# EAGLE design Alignment (EAGLE 6.6.0)
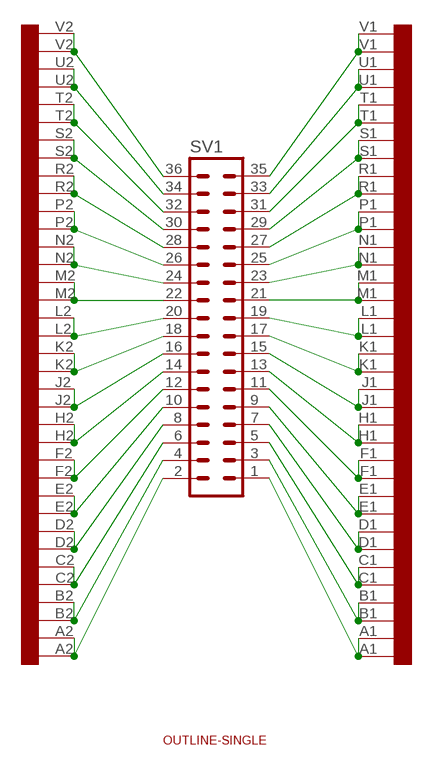
[diagram p0: schematic, sheet 1]

## Parts
EDGE  EDGE-2ECONO  [ECONOSINGLE]
SV1  MA18-2  [MA18-2]
U$1  EDGE-2CONNECTOR  [EDGE-CON2]
U$3  OUTLINE-SINGLE  [SINGLE]

## Nets
N$1: EDGE.V2 SV1.36 U$1.V2
N$2: EDGE.U2 SV1.34 U$1.U2
N$3: EDGE.T2 SV1.32 U$1.T2
N$4: EDGE.S2 SV1.30 U$1.S2
N$5: EDGE.R2 SV1.28 U$1.R2
N$6: EDGE.P2 SV1.26 U$1.P2
N$7: EDGE.N2 SV1.24 U$1.N2
N$8: EDGE.M2 SV1.22 U$1.M2
N$9: EDGE.L2 SV1.20 U$1.L2
N$10: EDGE.K2 SV1.18 U$1.K2
N$11: EDGE.J2 SV1.16 U$1.J2
N$12: EDGE.H2 SV1.14 U$1.H2
N$13: EDGE.F2 SV1.12 U$1.F2
N$14: EDGE.E2 SV1.10 U$1.E2
N$15: EDGE.D2 SV1.8 U$1.D2
N$16: EDGE.C2 SV1.6 U$1.C2
N$17: EDGE.B2 SV1.4 U$1.B2
N$18: EDGE.A2 SV1.2 U$1.A2
N$19: EDGE.V1 SV1.35 U$1.V1
N$20: EDGE.U1 SV1.33 U$1.U1
N$21: EDGE.T1 SV1.31 U$1.T1
N$22: EDGE.S1 SV1.29 U$1.S1
N$23: EDGE.R1 SV1.27 U$1.R1
N$24: EDGE.P1 SV1.25 U$1.P1
N$25: EDGE.N1 SV1.23 U$1.N1
N$26: EDGE.M1 SV1.21 U$1.M1
N$27: EDGE.L1 SV1.19 U$1.L1
N$28: EDGE.K1 SV1.17 U$1.K1
N$29: EDGE.J1 SV1.15 U$1.J1
N$30: EDGE.H1 SV1.13 U$1.H1
N$31: EDGE.F1 SV1.11 U$1.F1
N$32: EDGE.E1 SV1.9 U$1.E1
N$33: EDGE.D1 SV1.7 U$1.D1
N$34: EDGE.C1 SV1.5 U$1.C1
N$35: EDGE.B1 SV1.3 U$1.B1
N$36: EDGE.A1 SV1.1 U$1.A1

## Library data of the parts
EDGE U$1 = dec-con:EDGE-2: Double-Sided DEC edge connector.
SV1 = con-lstb:MA18-2: PIN HEADER; OC_FARNELL: unknown; OC_NEWARK: unknown
U$3 = dec-con:OUTLINE-*: Board outlines for DEC boards.

## Net classes
0 default: width 0.508 mm

## Board
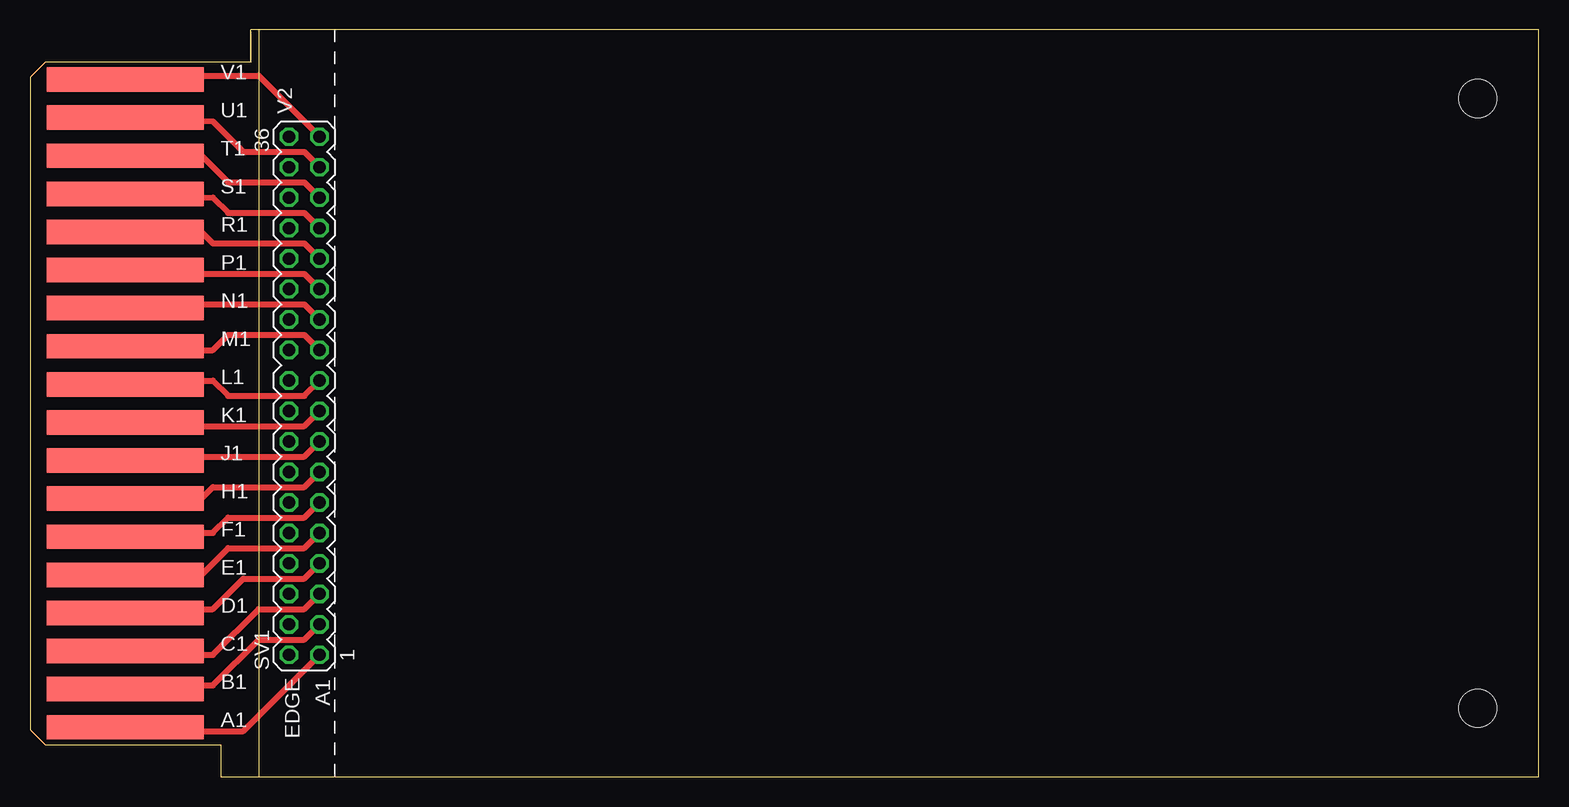
[diagram p1: board, top side]
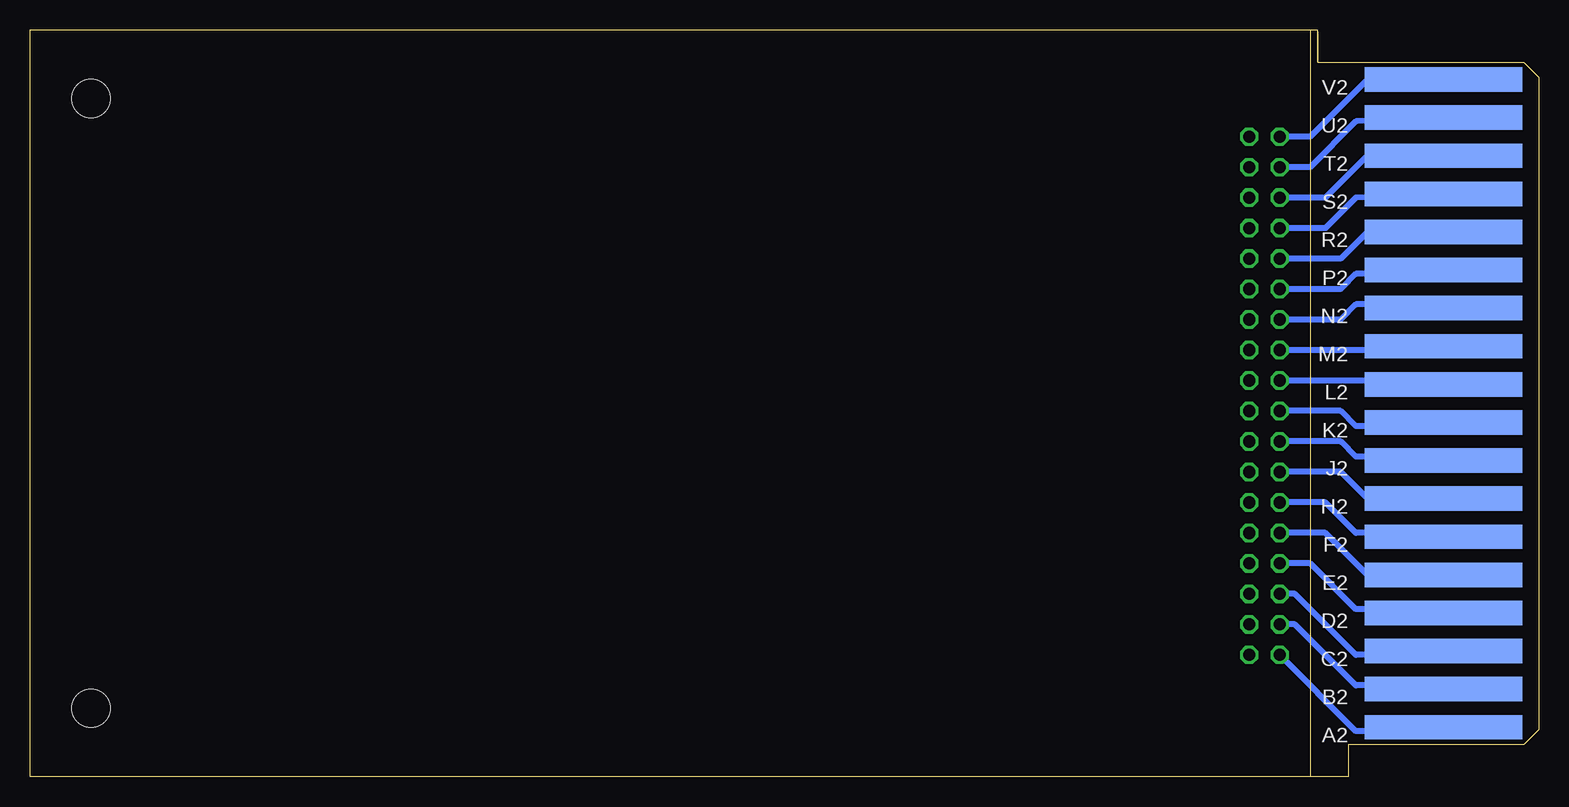
[diagram p2: board, bottom side, seen from below]

Size 125.73 x 62.23 mm. Coordinates in mm from the lower left corner, seen from the top.
Copper layers (1+16): Top 0.035mm / dielectric 1.5mm / Bottom 0.035mm
Design rules "16mils": minimum track width 16mil, minimum drill 32mil, track to track 15mil, track to pad 10mil, pad to pad 10mil, via to via 10mil, smd to smd 10mil, copper to edge 13mil, drill to drill 10mil, minimum pad ring 10mil, minimum via ring 8mil, stop-mask expansion 0mil, vias tented up to drill 0mil, thermal gap 10mil

### Footprints (pad centres in the part's own frame; a part is rotated, then mirrored left to right if it is on the bottom)
ECONOSINGLE = drill 1.016 octagon: A1 5.08,10.16; A2 2.54,10.16; B1 5.08,12.7; B2 2.54,12.7; C1 5.08,15.24; C2 2.54,15.24; D1 5.08,17.78; D2 2.54,17.78; E1 5.08,20.32; E2 2.54,20.32; F1 5.08,22.86; F2 2.54,22.86; H1 5.08,25.4; H2 2.54,25.4; J1 5.08,27.94; J2 2.54,27.94; K1 5.08,30.48; K2 2.54,30.48; L1 5.08,33.02; L2 2.54,33.02; M1 5.08,35.56; M2 2.54,35.56; N1 5.08,38.1; N2 2.54,38.1; P1 5.08,40.64; P2 2.54,40.64; R1 5.08,43.18; R2 2.54,43.18; S1 5.08,45.72; S2 2.54,45.72; T1 5.08,48.26; T2 2.54,48.26; U1 5.08,50.8; U2 2.54,50.8; V1 5.08,53.34; V2 2.54,53.34 | hole 3.175: 101.6,56.515; 101.6,5.715
MA18-2 = drill 1.016 octagon: 1 -21.59,-1.27; 2 -21.59,1.27; 3 -19.05,-1.27; 4 -19.05,1.27; 5 -16.51,-1.27; 6 -16.51,1.27; 7 -13.97,-1.27; 8 -13.97,1.27; 9 -11.43,-1.27; 10 -11.43,1.27; 11 -8.89,-1.27; 12 -8.89,1.27; 13 -6.35,-1.27; 14 -6.35,1.27; 15 -3.81,-1.27; 16 -3.81,1.27; 17 -1.27,-1.27; 18 -1.27,1.27; 19 1.27,-1.27; 20 1.27,1.27; 21 3.81,-1.27; 22 3.81,1.27; 23 6.35,-1.27; 24 6.35,1.27; 25 8.89,-1.27; 26 8.89,1.27; 27 11.43,-1.27; 28 11.43,1.27; 29 13.97,-1.27; 30 13.97,1.27; 31 16.51,-1.27; 32 16.51,1.27; 33 19.05,-1.27; 34 19.05,1.27; 35 21.59,-1.27; 36 21.59,1.27
EDGE-CON2 = smd 13.106 x 2.032: A1 7.938,4.128; B1 7.938,7.303; C1 7.938,10.477; D1 7.938,13.652; E1 7.938,16.828; F1 7.938,20.003; H1 7.938,23.177; J1 7.938,26.352; K1 7.938,29.527; L1 7.938,32.703; M1 7.938,35.877; N1 7.938,39.053; P1 7.938,42.227; R1 7.938,45.403; S1 7.938,48.578; T1 7.938,51.752; U1 7.938,54.928; V1 7.938,58.102 | smd 13.106 x 2.032 bottom: A2 7.938,4.128; B2 7.938,7.303; C2 7.938,10.477; D2 7.938,13.652; E2 7.938,16.828; F2 7.938,20.003; H2 7.938,23.177; J2 7.938,26.352; K2 7.938,29.527; L2 7.938,32.703; M2 7.938,35.877; N2 7.938,39.053; P2 7.938,42.227; R2 7.938,45.403; S2 7.938,48.578; T2 7.938,51.752; U2 7.938,54.928; V2 7.938,58.102
SINGLE = hole 3.175: 120.65,56.515; 120.65,5.715

### Placement (x,y rotation side)
EDGE  19.05,0 0 top
SV1  22.86,31.75 90 top
U$1  0,0 0 top
U$3  0,0 0 top

### Tracks (layer width: path | path; a pad name or v marks a point on that pad's centre or on a via)
N$1
  Bottom 0.508: EDGE.V2 19.05,53.34 13.97,58.42 U$1.V2
N$2
  Bottom 0.508: EDGE.U2 19.05,50.8 15.24,54.61 U$1.U2
N$3
  Bottom 0.508: EDGE.T2 17.78,48.26 13.97,52.07 U$1.T2
N$4
  Bottom 0.508: EDGE.S2 17.78,45.72 15.24,48.26 U$1.S2
N$5
  Bottom 0.508: EDGE.R2 16.51,43.18 13.97,45.72 U$1.R2
N$6
  Bottom 0.508: EDGE.P2 16.51,40.64 15.24,41.91 13.97,41.91 U$1.P2
N$7
  Bottom 0.508: EDGE.N2 16.51,38.1 15.24,39.37 13.97,39.37 U$1.N2
N$8
  Bottom 0.508: EDGE.M2 13.97,35.56 U$1.M2
N$9
  Bottom 0.508: EDGE.L2 13.97,33.02 U$1.L2
N$10
  Bottom 0.508: EDGE.K2 16.51,30.48 15.24,29.21 11.43,29.21 U$1.K2
N$11
  Bottom 0.508: EDGE.J2 16.51,27.94 15.24,26.67 13.97,26.67 U$1.J2
N$12
  Bottom 0.508: EDGE.H2 16.51,25.4 13.97,22.86 U$1.H2
N$13
  Bottom 0.508: EDGE.F2 17.78,22.86 15.24,20.32 13.97,20.32 U$1.F2
N$14
  Bottom 0.508: EDGE.E2 17.78,20.32 13.97,16.51 U$1.E2
N$15
  Bottom 0.508: EDGE.D2 19.05,17.78 15.24,13.97 13.97,13.97 U$1.D2
N$16
  Bottom 0.508: EDGE.C2 20.32,15.24 15.24,10.16 13.97,10.16 U$1.C2
N$17
  Bottom 0.508: EDGE.B2 20.32,12.7 15.24,7.62 13.97,7.62 U$1.B2
N$18
  Bottom 0.508: EDGE.A2 15.24,3.81 13.97,3.81 U$1.A2
N$19
  Top 0.508: EDGE.V1 19.05,58.42 12.7,58.42 U$1.V1
N$20
  Top 0.508: EDGE.U1 22.86,52.07 17.78,52.07 15.24,54.61 U$1.U1
N$21
  Top 0.508: EDGE.T1 22.86,49.53 16.51,49.53 13.97,52.07 U$1.T1
N$22
  Top 0.508: EDGE.S1 22.86,46.99 16.51,46.99 15.24,48.26 U$1.S1
N$23
  Top 0.508: EDGE.R1 22.86,44.45 15.24,44.45 13.97,45.72 U$1.R1
N$24
  Top 0.508: EDGE.P1 22.86,41.91 13.97,41.91 U$1.P1
N$25
  Top 0.508: EDGE.N1 22.86,39.37 13.97,39.37 U$1.N1
N$26
  Top 0.508: EDGE.M1 22.86,36.83 16.51,36.83 15.24,35.56 13.97,35.56 U$1.M1
N$27
  Top 0.508: EDGE.L1 22.86,31.75 16.51,31.75 15.24,33.02 11.43,33.02 U$1.L1
N$28
  Top 0.508: EDGE.K1 22.86,29.21 13.97,29.21 U$1.K1
N$29
  Top 0.508: EDGE.J1 22.86,26.67 13.97,26.67 U$1.J1
N$30
  Top 0.508: EDGE.H1 22.86,24.13 15.24,24.13 13.97,22.86 11.43,22.86 U$1.H1
N$31
  Top 0.508: EDGE.F1 22.86,21.59 16.51,21.59 15.24,20.32 13.97,20.32 U$1.F1
N$32
  Top 0.508: EDGE.E1 22.86,19.05 16.51,19.05 13.97,16.51 U$1.E1
N$33
  Top 0.508: EDGE.D1 22.86,16.51 17.78,16.51 15.24,13.97 13.97,13.97 U$1.D1
N$34
  Top 0.508: EDGE.C1 22.86,13.97 19.05,13.97 15.24,10.16 13.97,10.16 U$1.C1
N$35
  Top 0.508: EDGE.B1 22.86,11.43 19.05,11.43 15.24,7.62 13.97,7.62 U$1.B1
N$36
  Top 0.508: EDGE.A1 17.78,3.81 13.97,3.81 U$1.A1